# EAGLE design adaptateur_fusible (EAGLE 6.4)
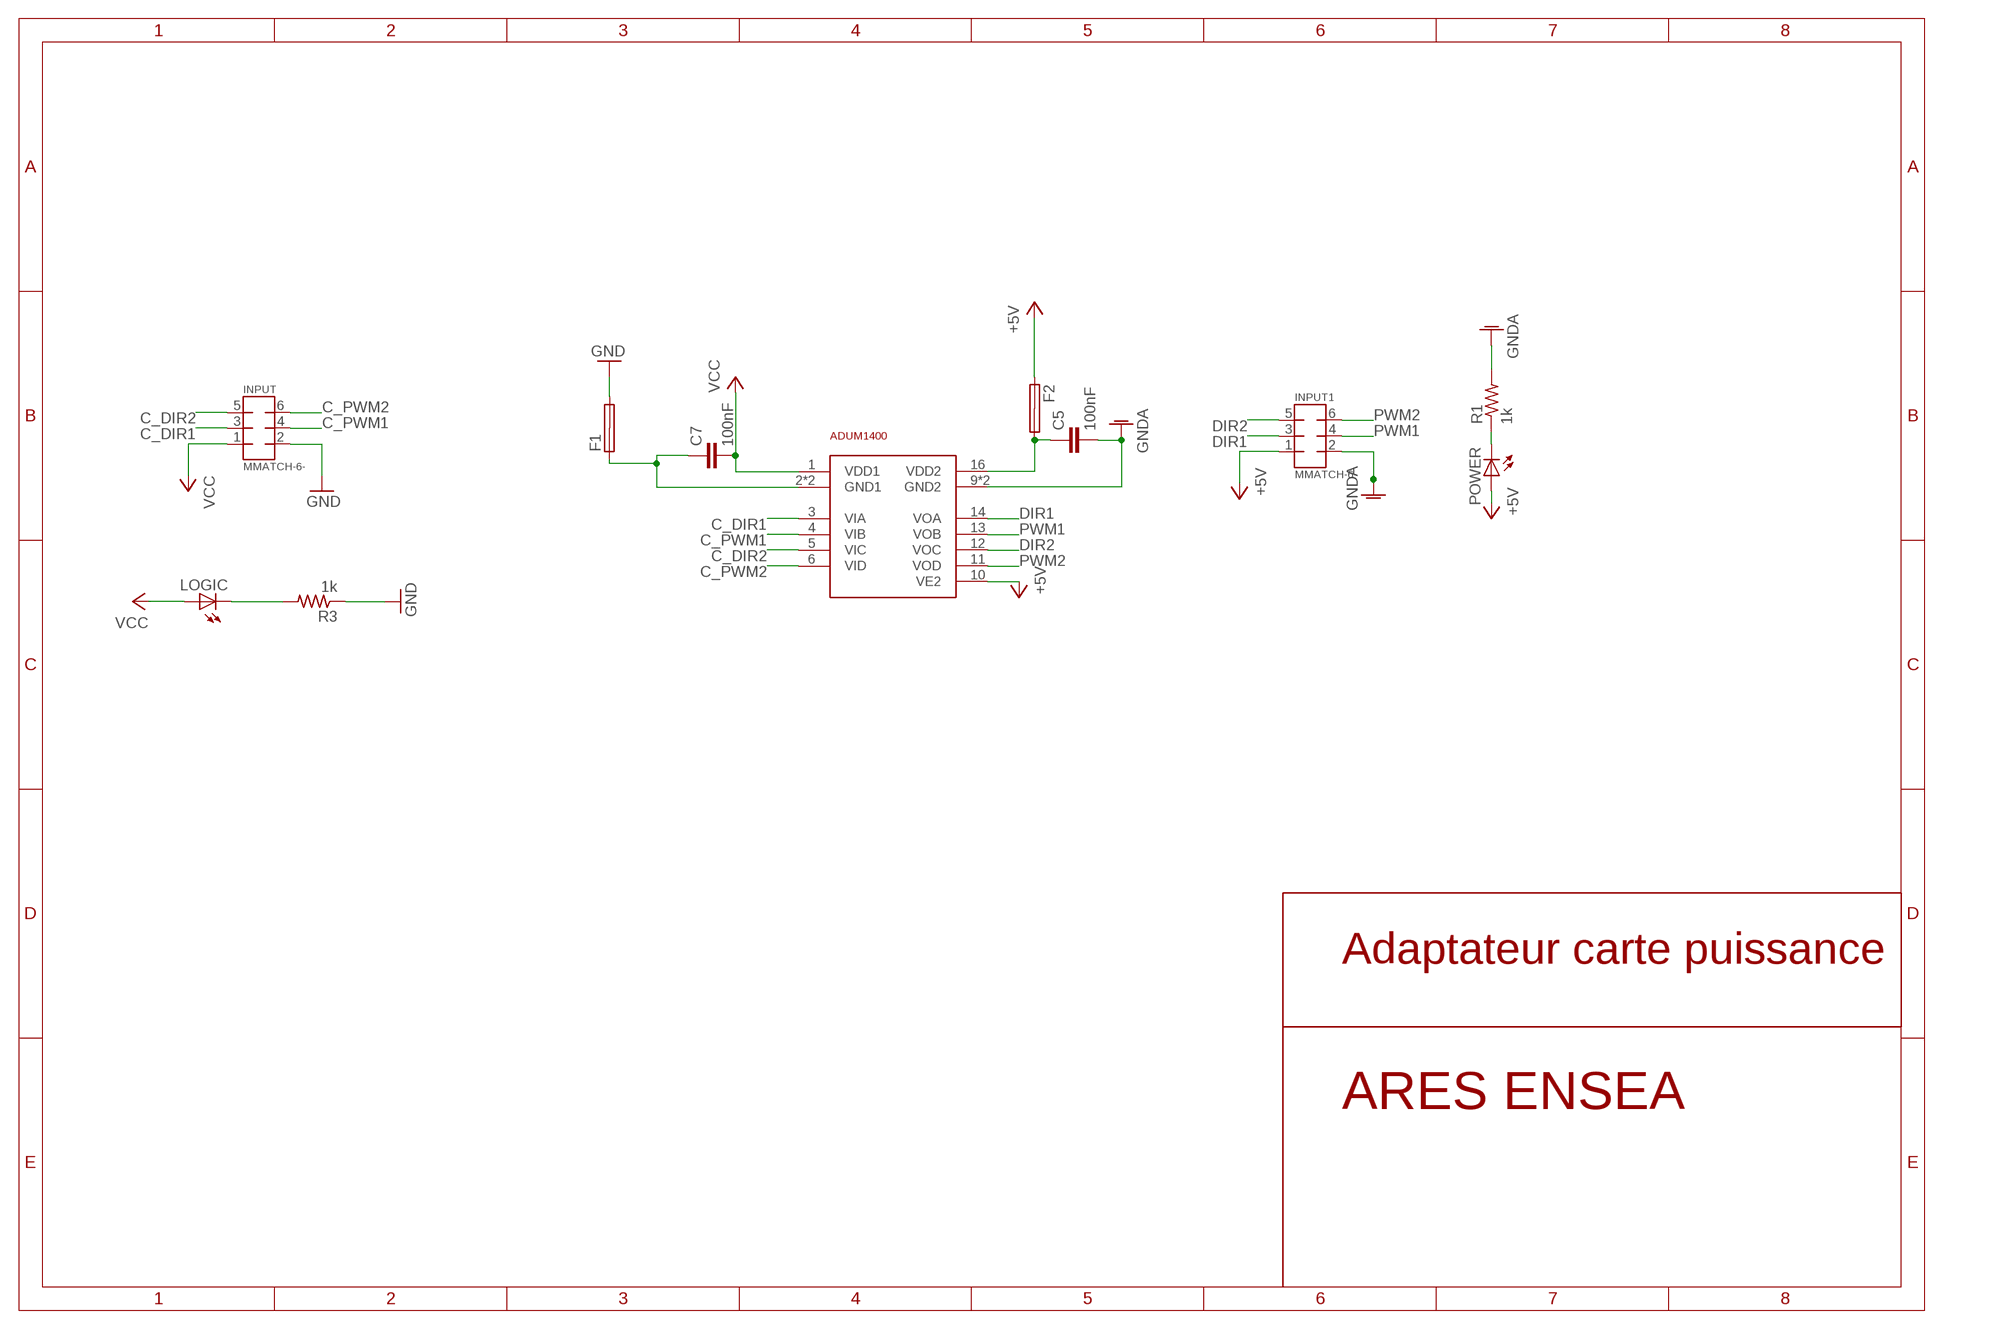
[diagram p0: schematic, sheet 1]

## Parts
C5  100nF  C-EUC0805  [C0805]
C7  100nF  C-EUC0805  [C0805]
F1  SHK20Q  [SHK20Q]
F2  SHK20Q  [SHK20Q]
INPUT  MMATCH-6-  [AMP-215079-6]
INPUT1  MMATCH-6-  [AMP-215079-6]
LOGIC  LEDSML0805  [SML0805]
POWER  LEDSML0805  [SML0805]
R1  1k  R-US_M0805  [M0805]
R3  1k  R-US_M0805  [M0805]
U$3  ADUM1400S  [SO-16W]

## Nets
+5V: F2.1A INPUT1.1 POWER.A U$3.10(VE2)
C_DIR1: INPUT.3 U$3.3(VIA)
C_DIR2: INPUT.5 U$3.5(VIC)
C_PWM1: INPUT.4 U$3.4(VIB)
C_PWM2: INPUT.6 U$3.6(VID)
DIR1: INPUT1.3 U$3.14(VOA)
DIR2: INPUT1.5 U$3.12(VOC)
GND: F1.2A INPUT.2 R3.1
GNDA: C5.2 INPUT1.2 R1.2 U$3.9(GND2) U$3.15(GND2)
N$1: C7.1 F1.1A U$3.2(GND1) U$3.8(GND1)
N$3: POWER.C R1.1
N$4: LOGIC.C R3.2
N$9: C5.1 F2.2A U$3.16(VDD2)
PWM1: INPUT1.4 U$3.13(VOB)
PWM2: INPUT1.6 U$3.11(VOD)
VCC: C7.2 INPUT.1 LOGIC.A U$3.1(VDD1)
Unconnected: F1.1B F1.2B F2.1B F2.2B

## Notes on the sheet
- Adaptateur carte puissance
- ARES ENSEA

## Library data of the parts
C5 C7 = rcl:C-EU: CAPACITOR, European symbol
F1 F2 = fuse:SHK20Q: FUSE HOLDER 5 x 20 mm, SH contact, E1207 Buerklin 64G6061; OC_FARNELL: unknown; OC_NEWARK: unknown
INPUT INPUT1 = jt-con-micromatch:MMATCH-6-*
LOGIC POWER = led:LED: LED OSRAM: - CHIPLED LG R971, LG N971, LY N971, LG Q971, LY Q971, LO R971, LY R971 LH N974, LH R974 LS Q976, LO Q976, LY Q976 LO Q996 - Hyper CHIPLED LW Q18S LB Q993, LB Q99A, LB R99A - SideLED LS A670, LO A670, LY A670, LG A670, LP A670 LB A673, LV A673, LT A673, LW A673 LH A674 LY A675 LS A676, LA A676, LO A676, LY A676, LW A676 LS A679, LY A679, LG A679 - Hyper Micro SIDELED® LS Y876, LA Y876, LO Y876, LY Y876 LT Y87S - SmartLED LW L88C, LW L88S LB L89C, LB L89S, LG L890 LS L89K, LO L89K, LY L89K LS L896, LA L896, LO L896, LY L896 - TOPLED LS T670, LO T670, LY T670, LG T670, LP T670 LSG T670, LSP T670, LSY T670, LOP T670, LYG T670 LG T671, LOG T671, LSG T671 LB T673, LV T673, LT T673, LW T673 LH T674 LS T676, LA T676, LO T676, LY T676, LB T676, LH T676, LSB T676, LW T676 LB T67C, LV T67C, LT T67C, LS T67K, LO T67K, LY T67K, LW E67C LS E67B, LA E67B, LO E67B, LY E67B, LB E67C, LV E67C, LT E67C LW T67C LS T679, LY T679, LG T679 LS T770, LO T770, LY T770, LG T770, LP T770 LB T773, LV T773, LT T773, LW T773 LH T774 LS E675, LA E675, LY E675, LS T675 LS T776, LA T776, LO T776, LY T776, LB T776 LHGB T686 LT T68C, LB T68C - Hyper Mini TOPLED® LB M676 - Mini TOPLED Santana® LG M470 LS M47K, LO M47K, LY M47K Source: http://www.osram.convergy.de LUXEON: - LUMILED® LXK2-PW12-R00, LXK2-PW12-S00, LXK2-PW14-U00, LXK2-PW14-V00 LXK2-PM12-R00, LXK2-PM12-S00, LXK2-PM14-U00 LXK2-PE12-Q00, LXK2-PE12-R00, LXK2-PE12-S00, LXK2-PE14-T00, LXK2-PE14-U00 LXK2-PB12-K00, LXK2-PB12-L00, LXK2-PB12-M00, LXK2-PB14-N00, LXK2-PB14-P00, LXK2-PB14-Q00 LXK2-PR12-L00, LXK2-PR12-M00, LXK2-PR14-Q00, LXK2-PR14-R00 LXK2-PD12-Q00, LXK2-PD12-R00, LXK2-PD12-S00 LXK2-PH12-R00, LXK2-PH12-S00 LXK2-PL12-P00, LXK2-PL12-Q00, LXK2-PL12-R00 Source: www.luxeon.com KINGBRIGHT: KA-3528ASYC Source: www.kingbright.com
R1 R3 = rcl:R-US_: RESISTOR, American symbol
U$3 = analog-devices:ADUM1400

## Board
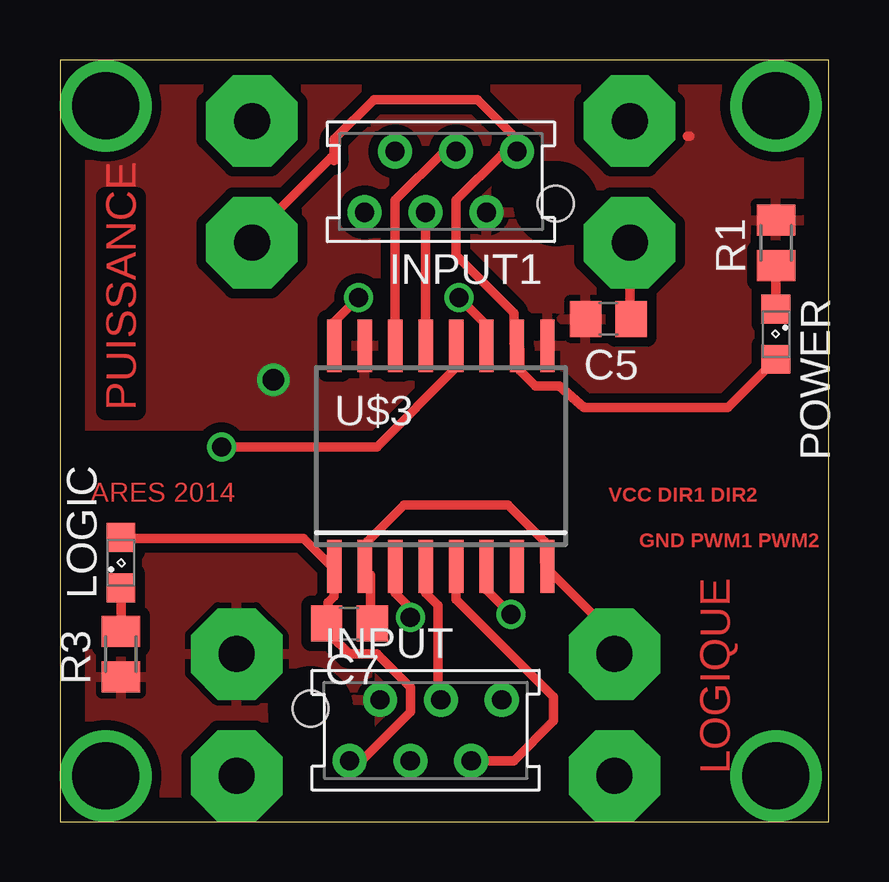
[diagram p1: board, top side]
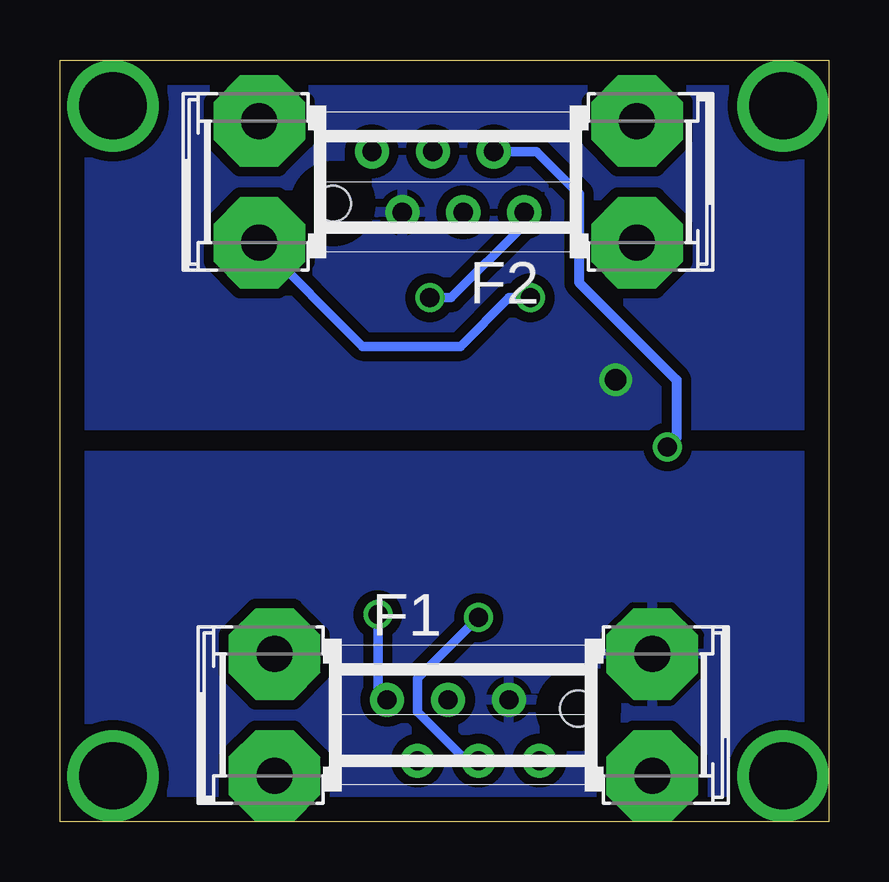
[diagram p2: board, bottom side, seen from below]

Size 32.05 x 31.74 mm. Coordinates in mm from the lower left corner, seen from the top.
Outline: 0,0 32.05,0 32.05,31.74 0,31.74 0,0
Copper layers (1*16): Top 0.035mm / dielectric 1.5mm / Bottom 0.035mm
Design rules "default *": minimum track width 0.4mm, minimum drill 0.8mm, track to track 0.3mm, track to pad 0.3mm, pad to pad 0.3mm, via to via 0.3mm, smd to smd 0.3mm, copper to edge 40mil, drill to drill 8mil, minimum pad ring 10mil, minimum via ring 8mil, stop-mask expansion 4mil, vias tented up to drill 0mil, thermal gap 10mil
vRestrict: area 10.8,12.1 to 21,19.1

### Footprints (pad centres in the part's own frame; a part is rotated, then mirrored left to right if it is on the bottom)
C0805 = smd 1.3 x 1.5: 1 -0.95,0; 2 0.95,0
SHK20Q = drill 1.5 pad 3.81 octagon: 1A -7.874,2.54; 1B -7.874,-2.54; 2A 7.874,2.54; 2B 7.874,-2.54
AMP-215079-6 = drill 0.8 pad 1.422: 1 0,0; 2 1.27,2.54; 3 2.54,0; 4 3.81,2.54; 5 5.08,0; 6 6.35,2.54 | hole 1.5: -1.62,2.175
SML0805 = smd 1.2 x 1.2: A 1.05,0; C -1.05,0
M0805 = smd 1.3 x 1.6: 1 -0.95,0; 2 0.95,0
SO-16W = smd 0.6 x 2.2: 1 -4.445,-4.6; 2 -3.175,-4.6; 3 -1.905,-4.6; 4 -0.635,-4.6; 5 0.635,-4.6; 6 1.905,-4.6; 7 3.175,-4.6; 8 4.445,-4.6; 9 4.445,4.6; 10 3.175,4.6; 11 1.905,4.6; 12 0.635,4.6; 13 -0.635,4.6; 14 -1.905,4.6; 15 -3.175,4.6; 16 -4.445,4.6

### Placement (x,y rotation side)
C5  22.86,20.95 180 top
C7  12.07,8.26 180 top
F1  15.24,4.45 0 bottom
F2  15.88,26.67 180 bottom
INPUT  12.07,2.54 0 top
INPUT1  19.05,27.94 180 top
LOGIC  2.54,10.79 90 top
POWER  29.85,20.32 270 top
R1  29.85,24.13 90 top
R3  2.54,6.99 90 top
U$3  15.88,15.24 0 top

### Tracks (layer width: path | path; a pad name or v marks a point on that pad's centre or on a via)
+5V
  Top 0.4: 11.43,27.56 11.43,27.69 | 11.43,27.69 11.43,28.45 13.08,30.1 17.4,30.1 19.05,28.45 INPUT1.1 18.92,27.81 18.41,27.81 16.51,25.91 16.51,23.62 18.92,21.21 18.92,19.94 U$3.10 19.18,19.68 19.18,18.8 19.81,18.16 20.83,18.16 21.84,17.27 27.85,17.27 POWER.A | F2.1A 8,24.38 11.3,27.69 11.43,27.69
C_DIR1  (via drill 0.8)
  Top 0.4: U$3.3 13.97,9.53 14.61,8.89 v14.61,8.51
  Bottom 0.4: v14.61,8.51 17.14,5.97 17.14,4.57 15.11,2.54 INPUT.3
C_DIR2
  Top 0.4: U$3.5 16.51,9.27 20.57,5.21 20.57,4.19 18.92,2.54 INPUT.5
C_PWM1
  Top 0.4: U$3.4 15.24,9.53 15.75,9.02 15.75,5.21 INPUT.4
C_PWM2  (via drill 0.8)
  Top 0.4: U$3.6 17.78,9.65 v18.8,8.64
  Bottom 0.4: v18.8,8.64 18.8,5.46 INPUT.6
DIR1
  Top 0.4: U$3.14 13.97,25.91 16,27.94 INPUT1.3
DIR2  (via drill 0.8)
  Top 0.4: U$3.12 16.51,18.92 13.21,15.62 v6.73,15.62
  Bottom 0.4: 6.73,16 v6.73,15.62 | 10.41,26.16 12.19,27.94 INPUT1.5
  Bottom 0.406: 10.41,26.16 10.41,22.48 6.35,18.41 6.35,16 v6.73,15.62
GND
  pour Top (isolate 0.406): -5.71,15.24 -5.71,-7.62 38.73,-7.62 38.73,15.24
  pour Bottom (isolate 0.406): -3.17,15.24 36.2,15.24 36.2,-5.08 -3.17,-5.08
GNDA  (via drill 0.9)
  Top 0.4: 26.16,28.57 26.26,28.57
  other vias: 8.89,18.41
  pour Top (isolate 0.406): -6.98,16.51 38.73,16.51 38.73,31.75 -5.71,31.75
  pour Bottom (isolate 0.406): -2.54,33.66 -3.17,16.51 36.2,16.51 36.2,33.66
N$1
  Top 0.4: C7.1 12.95,8.26 12.95,10.29 12.7,10.54 U$3.2 12.83,10.79 12.83,11.68 14.35,13.21 18.67,13.21 20.19,11.68 20.19,10.79 U$3.8 20.32,10.54 23.11,7.75 F1.1A
N$3
  Top 0.4: R1.1 POWER.C
N$4
  Top 0.4: R3.2 LOGIC.C
N$5  (via drill 2.8)
  other vias: 1.91,1.91
N$6  (via drill 2.8)
  other vias: 29.85,1.91
N$7  (via drill 2.8)
  other vias: 29.85,29.84
N$8  (via drill 2.8)
  other vias: 1.91,29.84
N$9  (via drill 0.8)
  Top 0.4: U$3.16 11.43,20.83 v12.45,21.84 | F2.2A 23.75,20.95 C5.1
  Bottom 0.4: v12.45,21.84 13.34,21.84 15.37,19.81 19.43,19.81 F2.2A
PWM1
  Top 0.4: INPUT1.4 U$3.13
PWM2  (via drill 0.8)
  Top 0.4: U$3.11 17.78,20.7 v16.64,21.84
  Bottom 0.4: v16.64,21.84 15.75,21.84 12.7,24.89 INPUT1.6
VCC
  Top 0.4: LOGIC.A 2.54,11.81 10.16,11.81 11.43,10.54 U$3.1 11.43,9.4 11.18,9.14 11.18,8.26 C7.2 11.3,8.13 11.3,7.75 12.07,6.99 13.21,6.99 14.61,5.59 14.61,4.57 12.57,2.54 INPUT.1

### Text on the board
Top: PUISSANCE | ARES 2014 | VCC DIR1 DIR2 | GND PWM1 PWM2 | LOGIQUE